# EAGLE design stuff-BASIC (EAGLE 9.6.2)
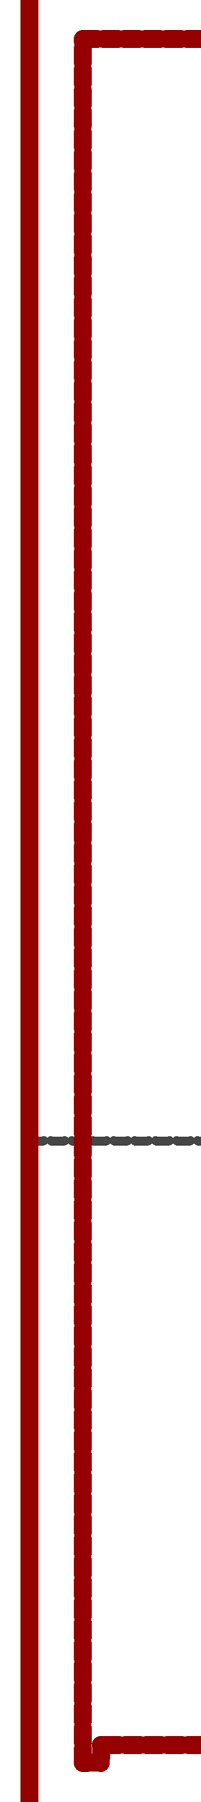
[diagram p0: schematic, sheet 1, part 1 of 2]
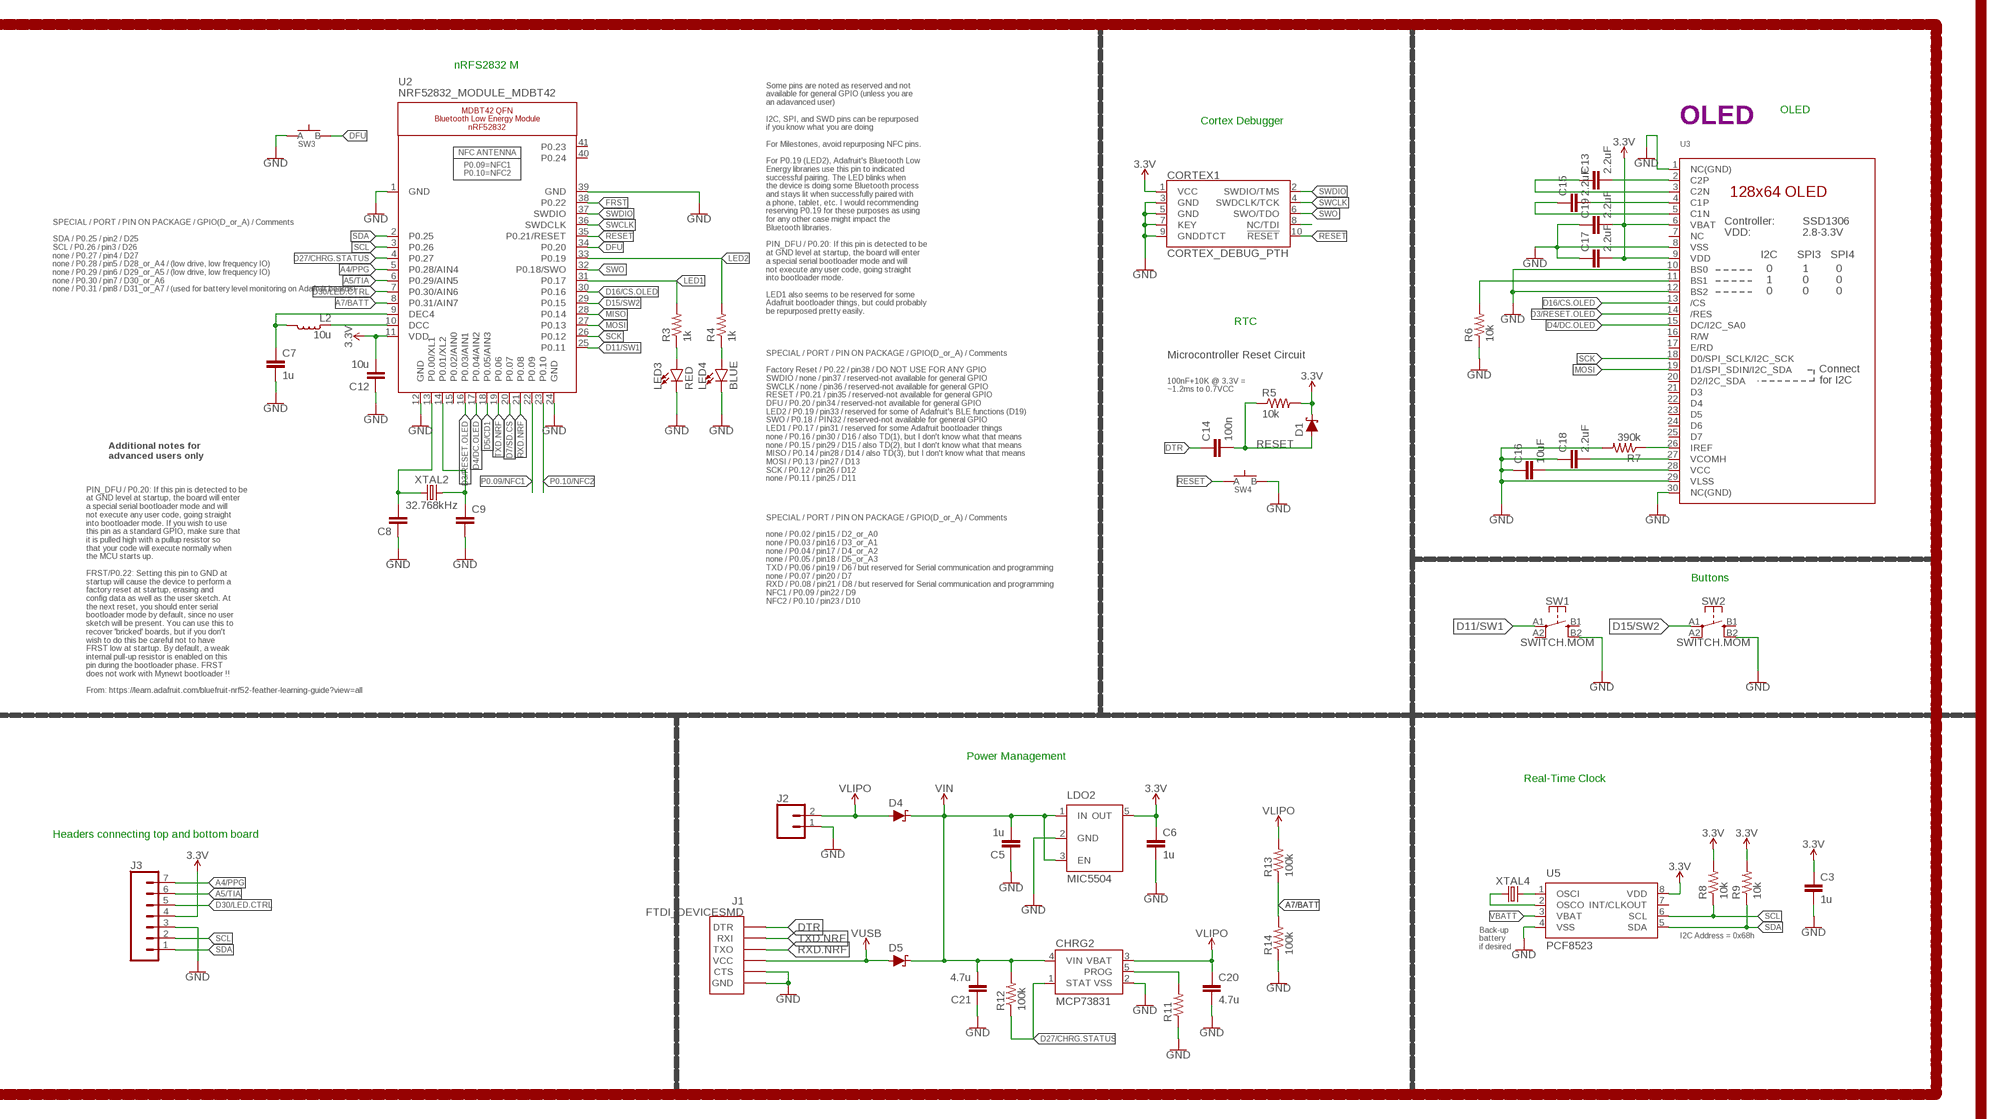
[diagram p1: schematic, sheet 1, part 2 of 2]

## Parts
C3  1u  CAPACITOR0603  [C0603]
C5  1u  CAPACITOR0603  [C0603]
C6  1u  CAPACITOR0603  [C0603]
C7  1u  CAPACITOR0603  [C0603]
C8  CAPACITOR0603  [C0603]
C9  CAPACITOR0603  [C0603]
C12  10u  CAPACITOR0805  [C0805]
C13  2.2uF  CAPACITOR0603  [C0603]
C14  100n  CAPACITOR0603  [C0603]
C15  2.2uF  CAPACITOR0603  [C0603]
C16  10uF  CAPACITOR0603  [C0603]
C17  2.2uF  CAPACITOR0603  [C0603]
C18  2.2uF  CAPACITOR0603  [C0603]
C19  2.2uF  CAPACITOR0603  [C0603]
C20  4.7u  CAPACITOR0603  [C0603]
C21  4.7u  CAPACITOR0603  [C0603]
CHRG2  MCP73831  [SOT23-5]
CORTEX1  CORTEX_DEBUG_PTH  [2X5-PTH-1.27MM]
D1  SCHOTTKY-USC  [USC]
D4  SCHOTTKY-USC  [USC]
D5  SCHOTTKY-USC  [USC]
J1  FTDI_DEVICESMD  [FTDI-SMD]
J2  CONN_02  [1X02]
J3  CONN_07-1.27MM  [1X07_1.27MM]
L2  10u  INDUCTOR0603  [L0603]
LDO2  MIC5504  [SOT23-5]
LED3  RED  LED0603  [LED-0603]
LED4  BLUE  LED0603  [LED-0603]
R3  1k  RESISTOR0603  [R0603]
R4  1k  RESISTOR0603  [R0603]
R5  10k  RESISTOR0603  [R0603]
R6  10k  RESISTOR0603  [R0603]
R7  390k  RESISTOR0603  [R0603]
R8  10k  RESISTOR0603  [R0603]
R9  10k  RESISTOR0603  [R0603]
R11  RESISTOR0603  [R0603]
R12  100k  RESISTOR0603  [R0603]
R13  100k  RESISTOR0603  [R0603]
R14  100k  RESISTOR0603  [R0603]
SW1  SWITCH.MOM  [TACTILE_SWITCH_SMD_6.2MM_TALL]
SW2  SWITCH.MOM  [TACTILE_SWITCH_SMD_6.2MM_TALL]
SW3  SPST-PTS830GG140-COPY.1-3  [BUTTON-GULLWING]
SW4  SPST-PTS830GG140-COPY.1-3  [BUTTON-GULLWING]
U2  NRF52832_MODULE_MDBT42  [BLE_MODULE_RAYTAC_MDBT42]
U3  DISP_OLED_UG-2864HSWEG01-NO-WRAPAROUND  [UG-2864HSWEG01_0.96IN_NO-WRAPAROUND]
U5  PCF8523  [SO8]
XTAL2  32.768kHz  CRYSTALECS-.327-12.5-12-C-TR  [2-SMD.NOLEAD.2.0MMTO1.2MM]
XTAL4  32.7680kHz  CRYSTALECS-.327-12.5-12-C-TR  [2-SMD.NOLEAD.2.0MMTO1.2MM]

## Nets
3.3V: C3.1 C6.1 C12.2 C17.2 C19.2 CORTEX1.1(VCC) D1.-(C) J3.4 LDO2.5(OUT) R5.2 R8.2 R9.2 U2.11(VDD) U3.6(VBAT) U3.9(VDD) U5.8(VDD)
A4/PPG: J3.7 U2.5(P0.28/AIN4)
A5/TIA: J3.6 U2.6(P0.29/AIN5)
A7/BATT: R13.1 R14.2 U2.8(P0.31/AIN7)
D3/RESET.OLED: U2.16(P0.03/AIN1) U3.14(/RES)
D4/DC.OLED: U2.17(P0.04/AIN2) U3.15(DC/I2C_SA0)
D5/CD1: U2.18(P0.05/AIN3)
D7/SD.CS: U2.20(P0.07)
D11/SW1: SW1.A1 U2.25(P0.11)
D15/SW2: SW2.A1 U2.29(P0.15)
D16/CS.OLED: U2.30(P0.16) U3.13(/CS)
D27/CHRG.STATUS: CHRG2.1(STAT) R12.1 U2.4(P0.27)
D30/LED.CTRL: J3.5 U2.7(P0.30/AIN6)
DFU: SW3.3(B) U2.34(P0.20)
DTR: C14.1 J1.DTR
FRST: U2.38(P0.22)
GND: C3.2 C5.1 C6.2 C7.2 C8.1 C9.2 C12.1 C16.1 C17.1 C18.1 C19.1 C20.2 C21.1 CHRG2.2(VSS) CORTEX1.3(GND) CORTEX1.5(GND) CORTEX1.7(KEY) CORTEX1.9(GNDDTCT) J1.CTS J1.GND J2.1 J3.3 LDO2.2(GND) LED3.C LED4.C R6.1 R7.2 R11.1 R14.1 SW1.B2 SW2.B2 SW3.1(A) SW4.3(B) U2.1(GND) U2.12(GND) U2.24(GND) U2.39(GND) U3.1(NC(GND)) U3.8(VSS) U3.10(BS0) U3.12(BS2) U3.29(VLSS) U3.30(NC(GND)) U5.4(VSS)
LED1: R3.2 U2.31(P0.17)
LED2: R4.2 U2.33(P0.19)
MISO: U2.28(P0.14)
MOSI: U2.27(P0.13) U3.19(D1/SPI_SDIN/I2C_SDA)
N$1: R6.2 U3.11(BS1)
N$2: R7.1 U3.26(IREF)
N$3: C13.2 U3.2(C2P)
N$4: C8.2 U2.13(P0.00/XL1) XTAL2.P$1
N$5: C13.1 U3.3(C2N)
N$6: C9.1 U2.14(P0.01/XL2) XTAL2.P$2
N$7: C15.2 U3.4(C1P)
N$8: C15.1 U3.5(C1N)
N$9: LED3.A R3.1
N$10: LED4.A R4.1
N$11: L2.1 U2.10(DCC)
N$12: C7.1 L2.2 U2.9(DEC4)
N$13: C16.2 U3.28(VCC)
N$14: CORTEX1.8(NC/TDI)
N$15: C18.2 U3.27(VCOMH)
N$17: CHRG2.5(PROG) R11.2
N$21: U5.2(OSCO) XTAL4.P$1
N$22: U5.1(OSCI) XTAL4.P$2
P0.09/NFC1: U2.22(P0.09)
P0.10/NFC2: U2.23(P0.10)
RESET: C14.2 CORTEX1.10(!RESET) D1.+(A) R5.1 SW4.1(A) U2.35(P0.21/RESET)
RXD.NRF: J1.TXO U2.21(P0.08)
SCK: U2.26(P0.12) U3.18(D0/SPI_SCLK/I2C_SCK)
SCL: J3.2 R8.1 U2.3(P0.26) U5.6(SCL)
SDA: J3.1 R9.1 U2.2(P0.25) U5.5(SDA)
SWCLK: CORTEX1.4(SWDCLK/TCK) U2.36(SWDCLK)
SWDIO: CORTEX1.2(SWDIO/TMS) U2.37(SWDIO)
SWO: CORTEX1.6(SWO/TDO) U2.32(P0.18/SWO)
TXD.NRF: J1.RXI U2.19(P0.06)
V_USB: D5.+(A) J1.VCC ; supply symbol labelled VUSB
VBATT: U5.3(VBAT)
VIN: C5.2 C21.2 CHRG2.4(VIN) D4.-(C) D5.-(C) LDO2.1(IN) LDO2.3(EN) R12.2
VLIPO: C20.1 CHRG2.3(VBAT) D4.+(A) J2.2 R13.2
Unconnected: SW1.A2 SW1.B1 SW2.A2 SW2.B1 U2.15(P0.02/AIN0) U2.40(P0.24) U2.41(P0.23) U3.7(NC) U3.16(R/W) U3.17(E/RD) U3.20(D2/I2C_SDA) U3.21(D3) U3.22(D4) U3.23(D5) U3.24(D6) U3.25(D7) U5.7(INT/CLKOUT)

## Notes on the sheet
- nRFS2832 M
- OLED
- Cortex Debugger | OLED
- SPECIAL / PORT / PIN ON PACKAGE / GPIO(D_or_A) / Comments
  
  SDA / P0.25 / pin2 / D25
  SCL / P0.26 / pin3 / D26
  none / P0.27 / pin4 / D27
  none / P0.28 / pin5 / D28_or_A4 / (low drive, low frequency IO)
  none / P0.29 / pin6 / D29_or_A5 / (low drive, low frequency IO)
  none / P0.30 / pin7 / D30_or_A6
  none / P0.31 / pin8 / D31_or_A7 / (used for battery level monitoring on Adafruit boards)
- Some pins are noted as reserved and not
  available for general GPIO (unless you are
  an adavanced user)
  
  I2C, SPI, and SWD pins can be repurposed
  if you know what you are doing
  
  For Milestones, avoid repurposing NFC pins.
  
  For P0.19 (LED2), Adafruit's Bluetooth Low
  Energy libraries use this pin to indicated
  successful pairing. The LED blinks when
  the device is doing some Bluetooth process
  and stays lit when successfully paired with
  a phone, tablet, etc. I would recommending
  reserving P0.19 for these purposes as using
  for any other case might impact the
  Bluetooth libraries.
  
  PIN_DFU / P0.20: If this pin is detected to be
  at GND level at startup, the board will enter
  a special serial bootloader mode and will
  not execute any user code, going straight
  into bootloader mode.
  
  LED1 also seems to be reserved for some
  Adafruit bootloader things, but could probably
  be repurposed pretty easily.
- RTC
- Microcontroller Reset Circuit
- 100nF+10K @ 3.3V =
  ~1.2ms to 0.7VCC
- Additional notes for
  advanced users only
- SPECIAL / PORT / PIN ON PACKAGE / GPIO(D_or_A) / Comments
  
  Factory Reset / P0.22 / pin38 / DO NOT USE FOR ANY GPIO
  SWDIO / none / pin37 / reserved-not available for general GPIO
  SWCLK / none / pin36 / reserved-not available for general GPIO
  RESET / P0.21 / pin35 / reserved-not available for general GPIO
  DFU / P0.20 / pin34 / reserved-not available for general GPIO
  LED2 / P0.19 / pin33 / reserved for some of Adafruit's BLE functions (D19)
  SWO / P0.18 / PIN32 / reserved-not available for general GPIO
  LED1 / P0.17 / pin31 / reserved for some Adafruit bootloader things
  none / P0.16 / pin30 / D16 / also TD(1), but I don't know what that means
  none / P0.15 / pin29 / D15 / also TD(2), but I don't know what that means
  MISO / P0.14 / pin28 / D14 / also TD(3), but I don't know what that means
  MOSI / P0.13 / pin27 / D13
  SCK / P0.12 / pin26 / D12
  none / P0.11 / pin25 / D11
- Buttons
- SPECIAL / PORT / PIN ON PACKAGE / GPIO(D_or_A) / Comments
  
  none / P0.02 / pin15 / D2_or_A0
  none / P0.03 / pin16 / D3_or_A1
  none / P0.04 / pin17 / D4_or_A2
  none / P0.05 / pin18 / D5_or_A3
  TXD / P0.06 / pin19 / D6 / but reserved for Serial communication and programming
  none / P0.07 / pin20 / D7
  RXD / P0.08 / pin21 / D8 / but reserved for Serial communication and programming
  NFC1 / P0.09 / pin22 / D9
  NFC2 / P0.10 / pin23 / D10
- PIN_DFU / P0.20: If this pin is detected to be
  at GND level at startup, the board will enter
  a special serial bootloader mode and will
  not execute any user code, going straight
  into bootloader mode. If you wish to use
  this pin as a standard GPIO, make sure that
  it is pulled high with a pullup resistor so
  that your code will execute normally when
  the MCU starts up.
  
  FRST/P0.22: Setting this pin to GND at
  startup will cause the device to perform a
  factory reset at startup, erasing and
  config data as well as the user sketch. At
  the next reset, you should enter serial
  bootloader mode by default, since no user
  sketch will be present. You can use this to
  recover 'bricked' boards, but if you don't
  wish to do this be careful not to have
  FRST low at startup. By default, a weak
  internal pull-up resistor is enabled on this
  pin during the bootloader phase. FRST
  does not work with Mynewt bootloader !!
  
  From: https://learn.adafruit.com/bluefruit-nrf52-feather-learning-guide?view=all
- Power Management
- Real-Time Clock
- Headers connecting top and bottom board
- I2C Address = 0x68h
- Back-up
  battery
  if desired

## Library data of the parts
C3 C5-C9 C12-C21 = LinnesLab-Passives:CAPACITOR
CHRG2 = LinnesLab-Power:MCP73831: MCP73831T Li-Ion, Li-Pol Controller Miniature single cell, fully integrated Li-Ion, Li-polymer charge management controller Datasheet <http://ww1.microchip.com/downloads/en/DeviceDoc/20001984g.pdf> SparkFun Products: SparkFun ESP32 Thing <https://www.sparkfun.com/products/13907> SparkFun 9DoF Razor IMU M0 <https://www.sparkfun.com/products/14001>; PROD_ID: IC-09995
CORTEX1 = LinnesLab-Connectors:CORTEX_DEBUG: Cortex Debug Connector - 10 pin Supports JTAG debug, Serial Wire debug, and Serial Wire Viewer. PTH and SMD connector options available. General Connector Information <http://infocenter.arm.com/help/topic/com.arm.doc.faqs/attached/13634/cortex_debug_connectors.pdf> Products: PTH Connector <http://www.digikey.com/product-detail/en/cnc-tech/3220-10-0100-00/1175-1627-ND/3883661> -via Digi-Key SparkFun PSoc <https://www.sparkfun.com/products/13229> SparkFun T <https://www.sparkfun.com/products/13810>
D1 D4 D5 = LinnesLab-DiscreteSemi:SCHOTTKY: Schottky diode A Schottky diode is a semiconductor diode which has a low forward voltage drop and a very fast switching action. Example: Digi-Key Part Number: RB161MM-20CT-ND
J1 = LinnesLab-Connectors:FTDI_DEVICE
J2 = LinnesLab-Connectors:CONN_02: Multi connection point. Often used as Generic Header-pin footprint for 0.1 inch spaced/style header connections On any of the 0.1 inch spaced packages, you can populate with these: Break Away Headers - Straight <https://www.sparkfun.com/products/116> (PRT-00116) Break Away Male Headers - Right Angle <https://www.sparkfun.com/products/553> (PRT-00553) Female Headers <https://www.sparkfun.com/products/115> (PRT-00115) Break Away Headers - Machine Pin <https://www.sparkfun.com/products/117> (PRT-00117) Break Away Female Headers - Swiss Machine Pin <https://www.sparkfun.com/products/743> (PRT-00743) For SCREWTERMINALS and SPRING TERMINALS visit here: Screw Terimnals on SparkFun.com <https://www.sparkfun.com/search/results?term=Screw+Terminals> (5mm/3.5mm/2.54mm spacing) This device is also useful as a general connection point to wire up your design to another part of your project. Our various solder wires solder well into these plated through hole pads. Hook-Up Wire - Assortment (Stranded, 22 AWG) <https://www.sparkfun.com/products/11375> (PRT-11375) Hook-Up Wire - Assortment (Solid Core, 22 AWG) <https://www.sparkfun.com/products/11367> (PRT-11367) View the entire wire category on our website here <https://www.sparkfun.com/categories/141> Special notes: Molex polarized connector foot print use with: PRT-08233 with associated crimp pins and housings. 2.54_SCREWTERM for use with PRT-10571. 3.5mm Screw Terminal footprints for PRT-08084 5mm Screw Terminal footprints for use with PRT-08432
J3 = LinnesLab-Connectors:CONN_07: Multi connection point. Often used as Generic Header-pin footprint for 0.1 inch spaced/style header connections On any of the 0.1 inch spaced packages, you can populate with these: Break Away Headers - Straight <https://www.sparkfun.com/products/116> (PRT-00116) Break Away Male Headers - Right Angle <https://www.sparkfun.com/products/553> (PRT-00553) Female Headers <https://www.sparkfun.com/products/115> (PRT-00115) Break Away Headers - Machine Pin <https://www.sparkfun.com/products/117> (PRT-00117) Break Away Female Headers - Swiss Machine Pin <https://www.sparkfun.com/products/743> (PRT-00743) For SCREWTERMINALS and SPRING TERMINALS visit here: Screw Terimnals on SparkFun.com <https://www.sparkfun.com/search/results?term=Screw+Terminals> (5mm/3.5mm/2.54mm spacing) This device is also useful as a general connection point to wire up your design to another part of your project. Our various solder wires solder well into these plated through hole pads. Hook-Up Wire - Assortment (Stranded, 22 AWG) <https://www.sparkfun.com/products/11375> (PRT-11375) Hook-Up Wire - Assortment (Solid Core, 22 AWG) <https://www.sparkfun.com/products/11367> (PRT-11367) View the entire wire category on our website here <https://www.sparkfun.com/categories/141> Special notes: Molex polarized connector foot print use with SKU : PRT-08231 with associated crimp pins and housings. 1MM SMD Version SKU: PRT-10208 NOTES ON THE VARIANTS LOCK and LOCK_LONGPADS... This footprint was designed to help hold the alignment of a through-hole component (i.e. 6-pin header) while soldering it into place. You may notice that each hole has been shifted either up or down by 0.005 of an inch from it's more standard position (which is a perfectly straight line). This slight alteration caused the pins (the squares in the middle) to touch the edges of the holes. Because they are alternating, it causes a "brace" to hold the component in place. 0.005 has proven to be the perfect amount of "off-center" position when using our standard breakaway headers. Although looks a little odd when you look at the bare footprint, once you have a header in there, the alteration is very hard to notice. Also,if you push a header all the way into place, it is covered up entirely on the bottom side.
L2 = LinnesLab-Passives:INDUCTOR
LDO2 = LinnesLab-Power:MIC5504: MIC5504 Voltage Regulator Output Voltages: 1.0V to 3.3V Input Voltages: 2.5V to 5.5V Link to Datasheet http://ww1.microchip.com/downloads/en/DeviceDoc/MIC550X.pdf
LED3 LED4 = LinnesLab-LED:LED: LED (Generic) Standard schematic elements and footprints for 5mm, 3mm, 1206, and 0603 sized LEDs. Generic LEDs with no color specified. LTST-C190KGKT: arrow indicates cathode
R3-R9 R11-R14 = LinnesLab-Passives:RESISTOR
SW1 SW2 = LinnesLab-Switches:SWITCH.MOM: PTS645SM43SMTR92 LFS
SW3 SW4 = LinnesLab-Switches:SPST-PTS830GG140-COPY
U2 = LinnesLab-Microcontrollers:NRF52832_MODULE_MDBT42: MDBT42 - BLE Module (nRF52832 QFN) VDD: 1.7-3.6V
U3 = LinnesLab-Displays:DISP_OLED_UG-2864HSWEG01: UG-2864HSWEG01 OLED display Both 1.3" and 0.96" models share the same FPC tab footprint, only the screen dimensions vary.
U5 = LinnesLab-Clocks:PCF8523; DIGIKEY: 568-5306-1-ND; I2C_ADDRESS: 0x68h; MFN: PCF8523T/1,118; MFN_MANUFACTURER: NXP USA Inc.
XTAL2 XTAL4 = LinnesLab-Clocks:CRYSTAL; DIGIKEY: XC2288CT-ND; FREQ: 32.7680KHZ; LOAD_CAP: 12.5pF

## Board
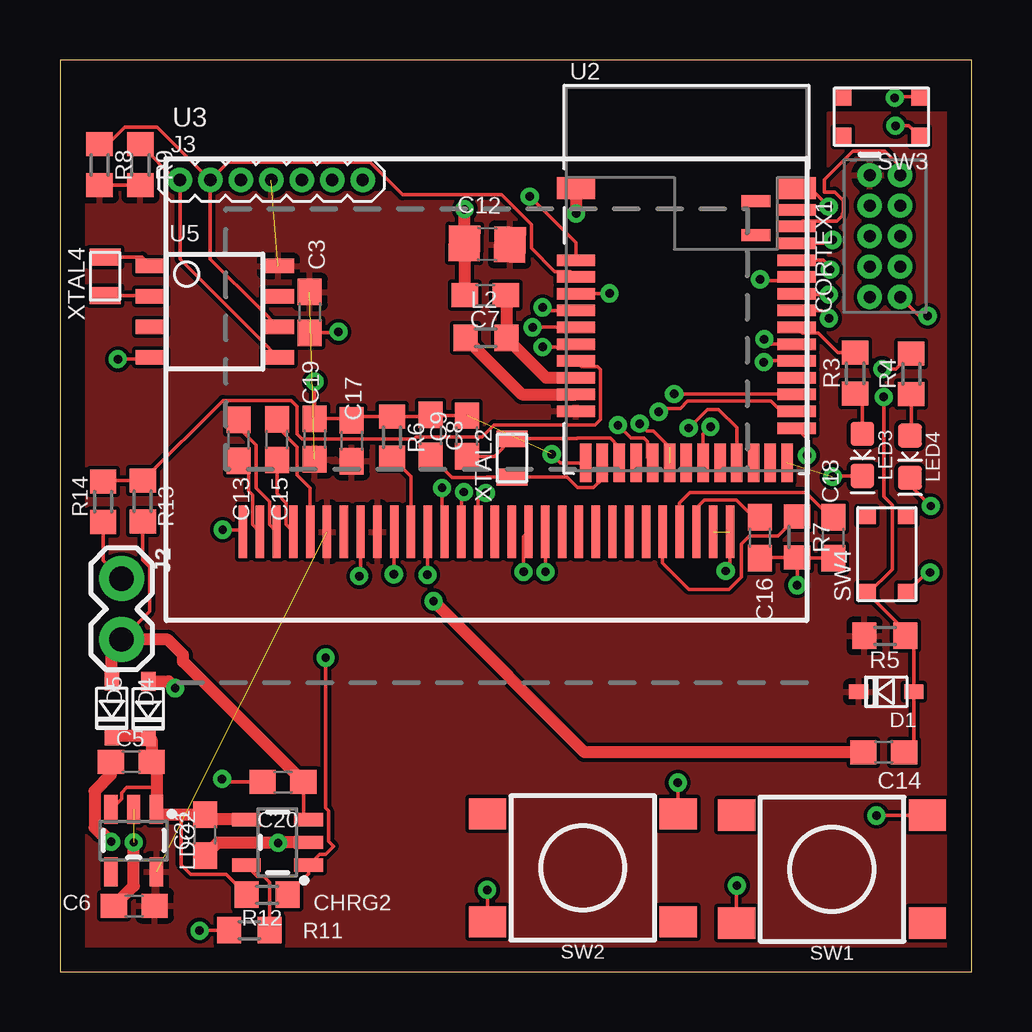
[diagram p2: board, top side]
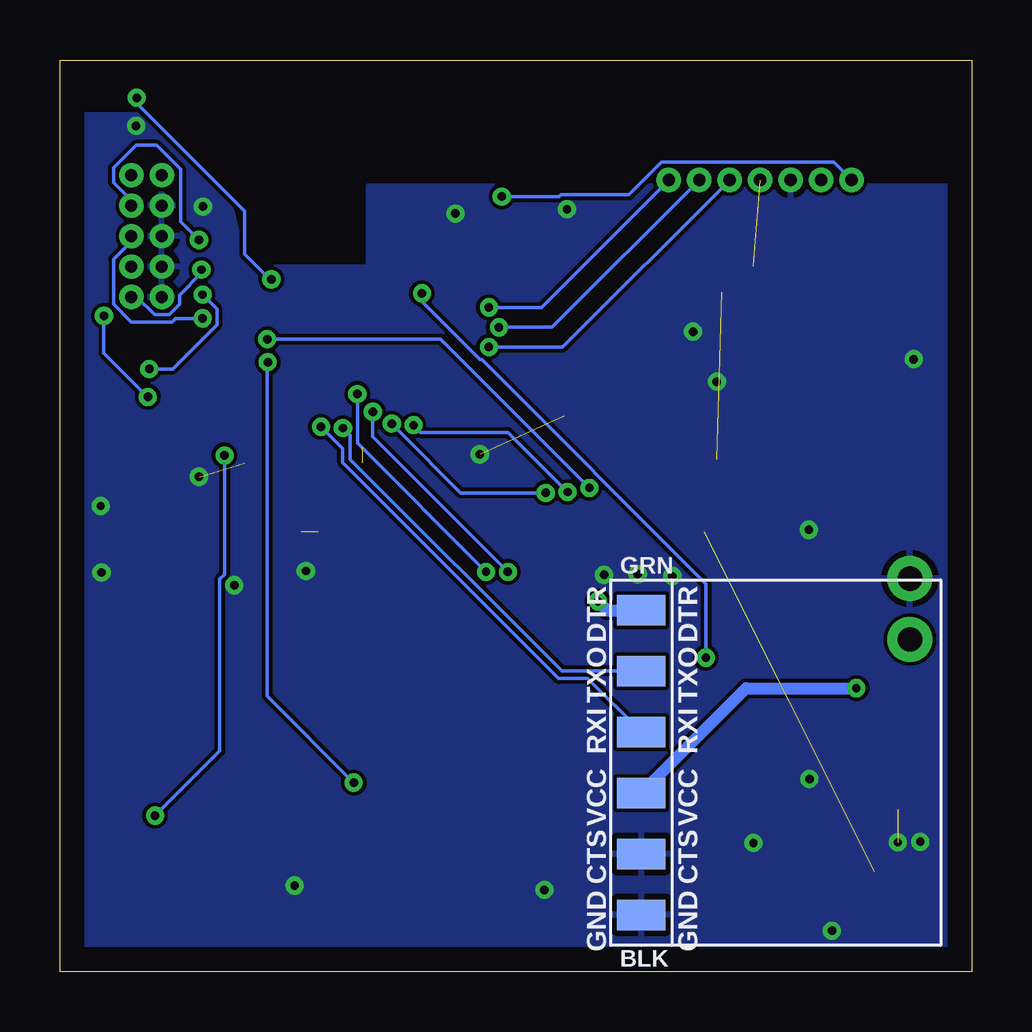
[diagram p3: board, bottom side, seen from below]

Size 38 x 38 mm. Coordinates in mm from the lower left corner, seen from the top.
Outline: 0,0 38,0 38,38 0,38 0,0
Copper layers (1*16): Top 0.035mm / dielectric 1.5mm / Bottom 0.035mm
Design rules "default": minimum track width 6mil, minimum drill 0.35mm, track to track 6mil, track to pad 6mil, pad to pad 6mil, via to via 6mil, smd to smd 6mil, copper to edge 40mil, drill to drill 6mil, minimum pad ring 10mil, minimum via ring 8mil, stop-mask expansion 4mil, vias tented up to drill 0mil, thermal gap 10mil

### Footprints (pad centres in the part's own frame; a part is rotated, then mirrored left to right if it is on the bottom)
C0603 = smd 1.1 x 1: 1 -0.85,0; 2 0.85,0
C0805 = smd 1.3 x 1.5: 1 -0.95,0; 2 0.95,0
SOT23-5 = smd 0.55 x 1.2: 1 -0.95,-1.3; 2 0,-1.3; 3 0.95,-1.3; 4 0.95,1.3; 5 -0.95,1.3
2X5-PTH-1.27MM = drill 0.508 pad 1: 1 -2.54,-0.635; 2 -2.54,0.635; 3 -1.27,-0.635; 4 -1.27,0.635; 5 0,-0.635; 6 0,0.635; 7 1.27,-0.635; 8 1.27,0.635; 9 2.54,-0.635; 10 2.54,0.635
USC = smd 0.8 x 0.6: + -1.15,0; - 1.15,0
FTDI-SMD = smd 1.27 x 2.03: CTS 3.81,0; DTR -6.35,0; GND 6.35,0; RXI -1.27,0; TXO -3.81,0; VCC 1.27,0
1X02 = drill 1.016 pad 1.88: 1 0,0; 2 2.54,0
1X07_1.27MM = drill 0.508 pad 1: 1 0,0; 2 1.27,0; 3 2.54,0; 4 3.81,0; 5 5.08,0; 6 6.35,0; 7 7.62,0
L0603 = smd 1 x 1.1: 1 -0.85,0; 2 0.85,0
LED-0603 = smd 1 x 1: A -0.877,0; C 0.877,0
R0603 = smd 1 x 1.1: 1 -0.85,0; 2 0.85,0
TACTILE_SWITCH_SMD_6.2MM_TALL = smd 1.55 x 1.3: A1 -3.975,-2.25; A2 3.975,-2.25; B1 -3.975,2.25; B2 3.975,2.25
BUTTON-GULLWING = smd 0.7 x 0.75: 1 -1.6,0.825; 2 1.6,0.825; 3 -1.6,-0.825; 4 1.6,-0.825
BLE_MODULE_RAYTAC_MDBT42 = smd 1.6 x 0.9: 1 -4.6,3.8; 39 4.6,3.8 | smd 1.6 x 0.48: 2 -4.6,0.8; 3 -4.6,0.1; 4 -4.6,-0.6; 5 -4.6,-1.3; 6 -4.6,-2; 7 -4.6,-2.7; 8 -4.6,-3.4; 9 -4.6,-4.1; 10 -4.6,-4.8; 11 -4.6,-5.5; 25 4.6,-6.2; 26 4.6,-5.5; 27 4.6,-4.8; 28 4.6,-4.1; 29 4.6,-3.4; 30 4.6,-2.7; 31 4.6,-2; 32 4.6,-1.3; 33 4.6,-0.6; 34 4.6,0.1; 35 4.6,0.8; 36 4.6,1.5; 37 4.6,2.2; 38 4.6,2.9 | smd 0.48 x 1.6: 12 -4.2,-7.65; 13 -3.5,-7.65; 14 -2.8,-7.65; 15 -2.1,-7.65; 16 -1.4,-7.65; 17 -0.7,-7.65; 18 0,-7.65; 19 0.7,-7.65; 20 1.4,-7.65; 21 2.1,-7.65; 22 2.8,-7.65; 23 3.5,-7.65; 24 4.2,-7.65 | smd 1.2 x 0.5: 40 2.9,3.25; 41 2.9,1.85
UG-2864HSWEG01_0.96IN_NO-WRAPAROUND = smd 0.35 x 2.2: 1 -10.15,-1.2; 2 -9.45,-1.2; 3 -8.75,-1.2; 4 -8.05,-1.2; 5 -7.35,-1.2; 6 -6.65,-1.2; 7 -5.95,-1.2; 8 -5.25,-1.2; 9 -4.55,-1.2; 10 -3.85,-1.2; 11 -3.15,-1.2; 12 -2.45,-1.2; 13 -1.75,-1.2; 14 -1.05,-1.2; 15 -0.35,-1.2; 16 0.35,-1.2; 17 1.05,-1.2; 18 1.75,-1.2; 19 2.45,-1.2; 20 3.15,-1.2; 21 3.85,-1.2; 22 4.55,-1.2; 23 5.25,-1.2; 24 5.95,-1.2; 25 6.65,-1.2; 26 7.35,-1.2; 27 8.05,-1.2; 28 8.75,-1.2; 29 9.45,-1.2; 30 10.15,-1.2
SO8 = smd 1.3 x 0.6: 1 -2.65,1.905; 2 -2.65,0.635; 3 -2.65,-0.635; 4 -2.65,-1.905; 5 2.65,-1.905; 6 2.65,-0.635; 7 2.65,0.635; 8 2.65,1.905
2-SMD.NOLEAD.2.0MMTO1.2MM = smd 0.7 x 1.3: P$1 -0.8,0; P$2 0.8,0

### Placement (x,y rotation side)
C3  10.41,27.48 270 top
C5  2.97,8.74 0 top
C6  3.1,2.74 180 top
C7  17.73,28.19 180 top
C8  15.44,22.35 270 top
C9  16.97,22.33 90 top
C12  17.81,30.33 358.7 top
C13  7.44,22.15 270 top
C14  34.34,9.14 0 top
C15  9.04,22.17 270 top
C16  29.18,18.08 90 top
C17  12.17,22.12 270 top
C18  32.23,18.08 90 top
C19  10.62,22.2 270 top
C20  9.3,7.9 180 top
C21  6.05,5.69 90 top
CHRG2  9.07,5.38 90 top
CORTEX1  34.39,30.66 270 top
D1  34.44,11.66 180 top
D4  2.16,10.97 270 top
D5  3.68,10.95 270 top
J1  13.77,8.71 270 bottom
J2  2.57,16.38 270 top
J3  5,33 0 top
L2  17.75,26.42 0 top
LDO2  3.07,5.46 180 top
LED3  33.45,21.54 270 top
LED4  35.43,21.46 270 top
R3  33.15,24.94 90 top
R4  35.48,24.92 90 top
R5  34.39,14 180 top
R6  13.84,22.28 270 top
R7  30.73,18.11 270 top
R8  1.65,33.63 270 top
R9  3.35,33.63 270 top
R11  7.9,1.73 0 top
R12  8.64,3.2 180 top
R13  3.45,19.61 270 top
R14  1.8,19.58 90 top
SW1  32.18,4.27 180 top
SW2  21.79,4.32 180 top
SW3  34.24,35.64 180 top
SW4  34.47,17.4 90 top
U2  26.11,28.85 0 top
U3  17.78,19.53 0 top
U5  6.45,27.51 0 top
XTAL2  18.85,21.41 90 top
XTAL4  1.88,28.98 90 top

### Tracks (layer width: path | path; a pad name or v marks a point on that pad's centre or on a via)
3.3V  (3 unrouted)
  Top 0.152: R8.2 R9.2
  pour Top: 0.81,32.46 25.15,32.46 25.15,29.34 32.03,29.34 32.03,35.79 37.47,35.79 37.47,0.53 0.74,0.53
A4/PPG  (via drill 0.35)
  Top 0.152: U2.5 20.25,27.55 v20.12,27.69
  Bottom 0.152: v20.12,27.69 17.93,27.69 J3.7
A5/TIA  (via drill 0.35)
  Top 0.152: U2.6 v19.7,26.85 v19.7,26.86
  Bottom 0.152: v19.7,26.86 17.5,26.86 J3.6
A7/BATT
  Top 0.152: R14.2 1.83,20.46 R13.1 6.8,23.8 9.64,23.8 9.89,23.55 9.89,22.41 10.1,22.2 14.76,22.2 14.85,22.28 17.59,22.28 18.1,22.79 22.31,22.79 22.54,23.02 22.54,25.09 22.41,25.22 21.74,25.22 U2.8
D3/RESET.OLED  (via drill 0.35)
  Top 0.152: v16.84,19.99 16.74,19.99 16.74,18.34 U3.14 | U2.16 24.48,21.44 24.48,22.1 24.35,22.23 23.8,22.23 v23.26,22.78
  Bottom 0.152: v16.84,19.99 19.33,22.48 22.96,22.48 v23.26,22.78
D4/DC.OLED  (via drill 0.35)  (1 unrouted)
  Top 0.152: U3.15 17.43,19.63 v17.75,19.95 | v24.17,22.84 24.47,22.54 24.74,22.54 25.41,21.87
  Bottom 0.152: v24.17,22.84 23.87,22.54 23.87,22.53 21.29,19.95 v17.75,19.95
D11/SW1  (via drill 0.35)
  Top 0.152: U2.25 31.14,22.23 v31.14,21.51 | v34.04,6.5 36.14,6.5 SW1.A1
  Bottom 0.152: v31.14,21.51 31.14,16.55 31.34,16.36 31.34,9.2 v34.04,6.5
D15/SW2  (via drill 0.35)
  Top 0.152: U2.29 30.69,25.48 29.34,25.48 v29.34,25.4 | v25.76,7.87 25.76,6.58 SW2.A1
  Bottom 0.152: v29.34,25.4 29.36,25.4 29.36,11.48 v25.76,7.87
D16/CS.OLED  (via drill 0.35)
  Top 0.152: U3.13 15.93,18.43 v15.93,20.16 | v29.36,26.36 29.39,26.36 29.59,26.15 U2.30
  Bottom 0.152: v15.93,20.16 22.13,26.36 v29.36,26.36
D27/CHRG.STATUS  (via drill 0.35)
  Top 0.152: R12.1 10.37,4.08 CHRG2.1 10.81,4.88 11.06,4.88 11.4,5.22 11.2,5.43 11.2,6.7 11.07,6.83 v11.07,13.08 | U2.4 21.53,28.27 v22.91,28.27
  Bottom 0.152: v22.91,28.27 22.91,27.92 20.5,25.5 20.41,25.5 11.07,16.16 v11.07,13.08
D30/LED.CTRL  (via drill 0.35)
  Top 0.152: U2.7 21.39,26.04 v20.12,26.04
  Bottom 0.152: v20.12,26.04 17.05,26.04 J3.5
DFU  (via drill 0.35)
  Top 0.152: SW3.3 34.84,36.46 v34.8,36.42 | v29.18,28.85 29.23,28.8 30.56,28.8 U2.34
  Bottom 0.152: v34.8,36.42 34.8,36.2 30.3,31.7 30.3,29.9 29.25,28.85 v29.18,28.85
DTR  (via drill 0.35)
  Top 0.508: C14.1 21.87,9.14 v15.57,15.44
  Bottom 0.508: v15.57,15.44 15.2,15.06 J1.DTR
GND  (via drill 0.35)  (4 unrouted)
  Top 0.152: 35.36,20.66 LED4.C 35.43,20.27 v36.3,19.41 | SW3.1 35.4,35.26 v34.83,35.26 | SW4.3 36.13,16.64 v36.27,16.64 | U3.1 7.55,18.41 v6.78,18.41 | U3.8 12.53,16.54 v12.47,16.48 | U3.10 13.93,16.57 v13.92,16.56 | U3.12 v15.33,16.55 v15.32,16.54 | v10.62,24.59 C19.1 12.09,23.05 C17.1 12.32,23.13 R6.1 15.37,23.13 C8.1 15.47,23.18 C9.2 | U2.12 20.86,21.2 v20.5,21.57 | J2.1 1.8,17.14 R14.1 | C16.1 29.21,17.26 R7.2 | R7.2 v30.73,16.1 | U3.30 27.93,16.87 v27.75,16.7 | R7.2 30.76,17.23 C18.1 | LED3.C 32.24,20.66 v32.21,20.62 | SW1.B2 28.21,3.57 v28.22,3.58 | SW2.B2 v17.82,3.39 v17.8,3.4 | R11.1 5.84,1.73 v5.82,1.7 | C3.2 11.57,26.63 v11.61,26.67 | C20.2 6.88,7.9 v6.76,8.03 | U2.39 31.28,32.65 v32.04,31.89 | U5.4 3.73,25.53 v2.41,25.53
  Top 0.508: 2.12,8.64 C5.1 2.12,8.21 1.44,7.53 1.44,5.99 1.68,5.75 1.79,5.75 v2.13,5.41 | C6.2 3.07,3.57 v3.07,5.38 | CHRG2.2 9.12,5.38 | 9.12,5.38 v9.09,5.36 | C21.1 6.59,5.38 9.12,5.38 | U2.1 v21.51,31.6 | C7.2 16.86,28.22 C12.1 16.86,31.77 v16.87,31.77
  pour Bottom: 0.74,32.79 25.17,32.79 25.17,29.41 30.23,29.41 30.23,29.34 31.8,35.76 37.57,35.76 37.57,0.58 0.66,0.58
LED1
  Top 0.152: R3.2 32.44,25.79 31.61,26.62 30.94,26.62 U2.31
LED2  (via drill 0.35)
  Top 0.152: v32.05,28.22 30.75,28.22 U2.33 | R4.2 34.84,25.12 v34.28,25.12
  Bottom 0.152: v34.28,25.12 33.3,25.12 31.45,26.98 31.45,27.61 v32.05,28.22
MOSI  (via drill 0.35)
  Top 0.152: U3.19 v20.23,16.67 v20.24,16.66 | v25.6,24.08 30.69,24.08 U2.27
  Bottom 0.152: v25.6,24.08 25.6,22.03 v20.24,16.66
N$1
  Top 0.152: R6.2 14.63,20.64 U3.11
N$2
  Top 0.152: U3.26 25.12,17.04 26.22,15.94 27.89,15.94 28.41,16.45 28.41,17.83 28.73,18.16 29.93,18.16 R7.1
N$3
  Top 0.152: U3.2 8.03,18.63 8.03,19.87 7.87,20.04 7.87,20.88 C13.2
N$4
  Top 0.152: C8.2 16.35,20.6 17.79,20.6 17.81,20.61 XTAL2.P$1 21.14,20.61 21.58,20.18 22.25,20.18 22.61,20.54 U2.13
N$5
  Top 0.152: U3.3 8.73,18.63 8.73,19.6 8.17,20.16 8.17,21.94 7.44,22.67 C13.1
N$6
  Top 0.152: C9.1 18.11,21.48 XTAL2.P$2 21.56,22.21 21.58,22.23 22.95,22.23 23.31,21.87 U2.14
N$7
  Top 0.152: U3.4 9.43,18.63 9.43,19.53 9.04,19.92 C15.2
N$8
  Top 0.152: U3.5 10.43,20.16 9.89,20.7 9.89,21.87 9.07,22.69 9.07,23.02 C15.1
N$9
  Top 0.152: R3.1 33.45,23.79 LED3.A
N$10
  Top 0.152: R4.1 35.48,22.39 LED4.A
N$11
  Top 0.508: L2.1 19.27,24.05 U2.10
N$12
  Top 0.508: U2.9 20.27,24.75 L2.2 18.61,28.17 C7.1
N$13
  Top 0.152: U3.28 26.52,18.34 26.52,19.32 26.86,19.66 28.2,19.66 28.93,18.93 C16.2
N$15
  Top 0.152: U3.27 25.82,18.34 25.82,19.53 26.26,19.97 31.1,19.97 32.13,18.93 C18.2
N$17
  Top 0.152: CHRG2.5 8.22,3.98 8.48,3.98 8.75,3.71 R11.2
N$21
  Top 0.152: XTAL4.P$1 3.76,28.18 U5.2
N$22
  Top 0.152: XTAL4.P$2 3.43,29.78 U5.1
RESET  (via drill 0.35)
  Top 0.152: U2.35 31.81,29.65 32.11,29.36 v32.11,29.26 | SW4.1 33.69,15.76 | 33.69,15.76 35.24,14.2 R5.1 35.59,13.64 D1.+ 35.59,9.55 C14.2 | 33.69,15.76 34.69,16.76 34.69,19.44 34.34,19.79 v34.34,23.95 | CORTEX1.10 35.81,27.33 v36.17,27.33
  Bottom 0.152: CORTEX1.10 34.8,28.12 34.06,27.38 33.45,27.38 33.02,27.81 33.02,28.19 32.11,29.11 v32.11,29.26 | v36.17,27.33 36.17,25.78 v34.34,23.95
RXD.NRF  (via drill 0.35)
  Top 0.152: v26.21,22.66 26.99,23.44 27.46,23.44 28.21,22.68 U2.21
  Bottom 0.152: v26.21,22.66 25.91,22.36 25.91,21.35 17.08,12.52 J1.TXO
SCK  (via drill 0.35)
  Top 0.152: U3.18 19.33,18.13 v19.33,16.66 | U2.26 30.05,23.35 29.63,23.77 26.16,23.77 25.86,23.47 25.1,23.47 v24.96,23.33
  Bottom 0.152: v24.96,23.33 24.96,22.29 v19.33,16.66
SCL
  Top 0.152: U5.6 8.36,27.61 6.27,29.7 J3.2 | R8.1 1.98,34.48 2.71,35.21 4.06,35.21 J3.2 | U2.3 21.28,29.19 20.62,29.19 19.65,30.15 19.65,31.14 18.4,32.38 14.28,32.38 12.93,33.74 7.01,33.74 J3.2
SDA  (via drill 0.35)
  Top 0.152: U5.5 8.36,26.34 5,29.7 J3.1 4.83,33 R9.1 | U2.2 21.51,30.38 v19.58,32.31
  Bottom 0.152: v19.58,32.31 17.19,32.31 17.12,32.38 14.28,32.38 12.93,33.74 5.74,33.74 J3.1
SWCLK  (via drill 0.35)
  Top 0.152: U2.36 32.06,30.35 v32.21,30.5
  Bottom 0.152: v32.21,30.5 32.97,31.26 32.97,33.45 33.96,34.44 34.82,34.44 35.76,33.5 35.76,32.89 35.03,32.16 CORTEX1.4
SWDIO
  Top 0.152: CORTEX1.2 35.03,33.55 34.39,34.19 33.05,34.19 31.86,33.01 31.86,32.5 31.87,32.5 32.29,32.5 32.65,32.14 32.65,31.64 32.61,31.6 32.61,31.5 32.39,31.29 30.94,31.29 U2.37
SWO  (via drill 0.35)
  Top 0.152: U2.32 31.73,27.55 v32.05,27.23
  Bottom 0.152: CORTEX1.6 35.03,30.43 35.76,29.69 35.76,27.81 35.03,27.08 33.33,27.08 33.17,27.23 v32.05,27.23
TXD.NRF  (via drill 0.35)
  Top 0.152: v27.12,22.71 26.81,22.4 U2.19
  Bottom 0.152: J1.RXI 16,12.22 17.21,12.22 26.21,21.22 26.21,21.8 v27.12,22.71
V_USB  (via drill 0.35)
  Top 0.508: D5.+ 4.51,12.1 v4.8,11.81
  Bottom 0.508: J1.VCC 9.4,11.81 v4.8,11.81
VIN
  Top 0.152: LDO2.3 2.57,7.21 2.57,7.46 2.79,7.67 4.02,7.67 | R12.2 6.92,4.06 5.45,4.06 5.05,4.46 5.05,6.54
  Top 0.508: D4.- 3.66,9.82 D5.- 3.82,9.66 C5.2 4.02,8.54 4.02,7.67 LDO2.1 4.25,6.54 5.05,6.54 C21.2 6.25,6.33 CHRG2.4
VLIPO
  Top 0.152: CHRG2.3 10.15,6.56 C20.1 | R13.2 3.45,17.15 3.73,16.87 3.73,15.01 J2.2
  Top 0.508: D4.+ 2.16,13.44 J2.2 4.49,13.84 5.13,13.2 5.13,12.92 C20.1